# EAGLE schematic atv_02 (EAGLE 9.6.2)
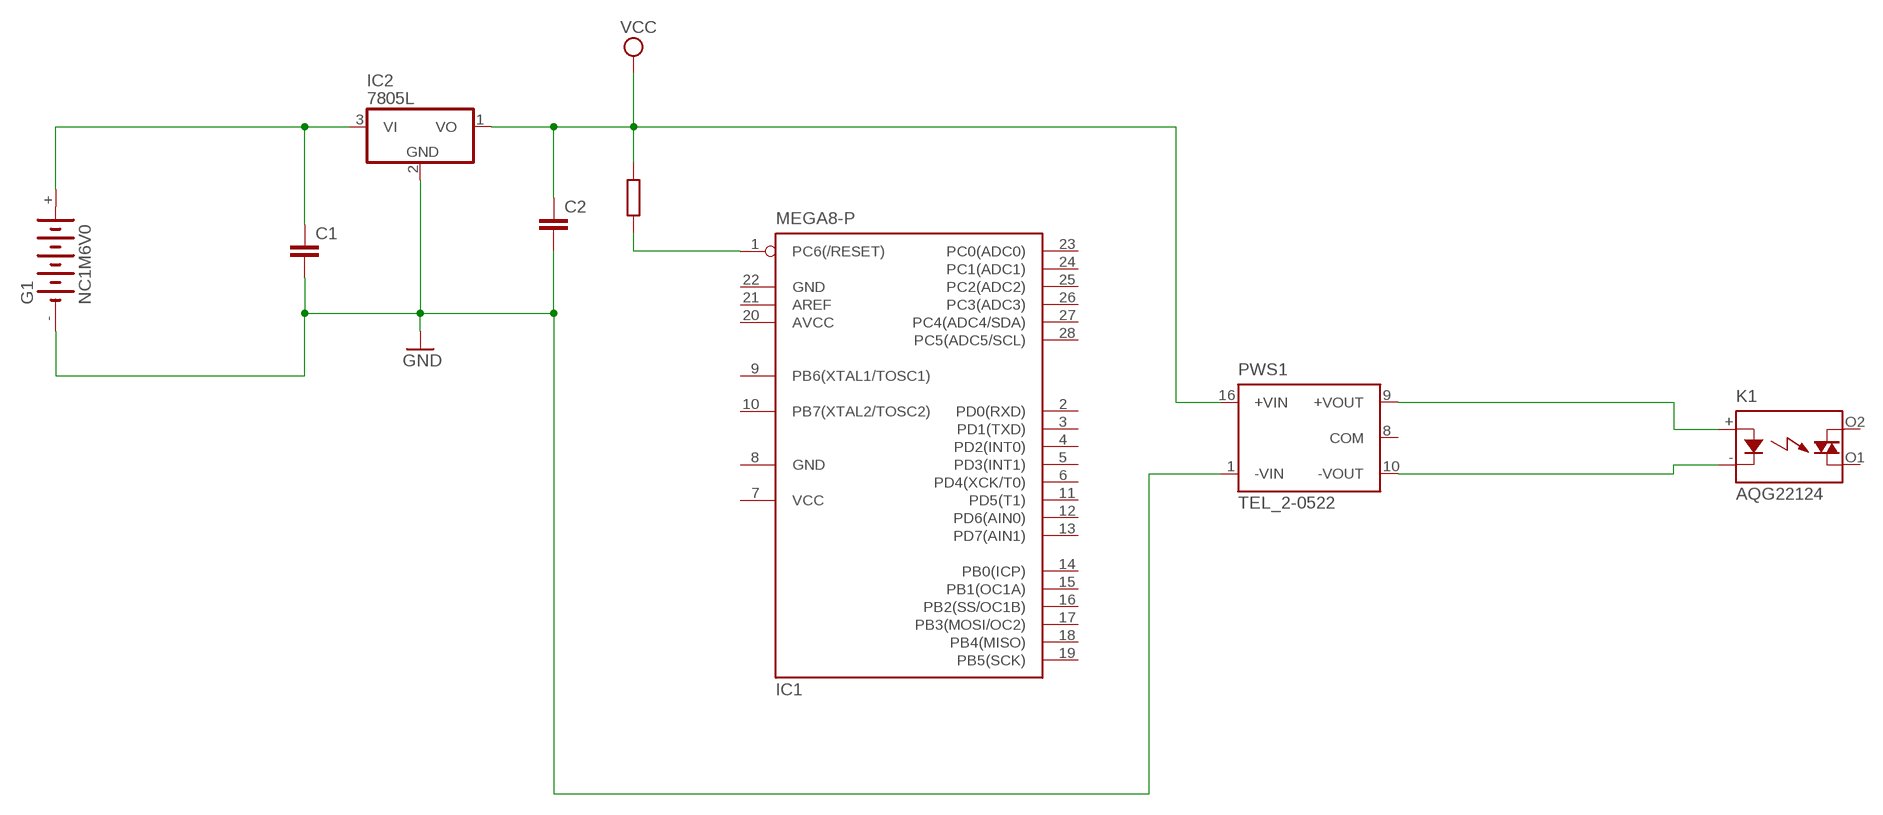
[diagram p0: schematic, sheet 1]

## Parts
C1  C2,5-3  [C2.5-3]
C2  C2,5-3  [C2.5-3]
G1  NC1M6V0  [NC1M]
IC1  MEGA8-P  [DIL28-3]
IC2  7805L  [TO92]
K1  AQG22124  [AQG]
PWS1  TEL_2-0522  [TRACOPOWER2W]

## Nets
GND: C1.2 C2.2 G1.- IC2.2(GND) PWS1.1(-VIN)
N$1: C1.1 G1.+ IC2.3(VI)
N$2: IC1.1(PC6(/RESET))
N$3: K1.+(A) PWS1.9(+VOUT)
N$4: K1.-(K) PWS1.10(-VOUT)
VCC: C2.1 IC2.1(VO) PWS1.16(+VIN)
Unconnected: IC1.2(PD0(RXD)) IC1.3(PD1(TXD)) IC1.4(PD2(INT0)) IC1.5(PD3(INT1)) IC1.6(PD4(XCK/T0)) IC1.9(PB6(XTAL1/TOSC1)) IC1.10(PB7(XTAL2/TOSC2)) IC1.11(PD5(T1)) IC1.12(PD6(AIN0)) IC1.13(PD7(AIN1)) IC1.14(PB0(ICP)) IC1.15(PB1(OC1A)) IC1.16(PB2(SS/OC1B)) IC1.17(PB3(MOSI/OC2)) IC1.18(PB4(MISO)) IC1.19(PB5(SCK)) IC1.21(AREF) IC1.23(PC0(ADC0)) IC1.24(PC1(ADC1)) IC1.25(PC2(ADC2)) IC1.26(PC3(ADC3)) IC1.27(PC4(ADC4/SDA)) IC1.28(PC5(ADC5/SCL)) K1.O1(DS2) K1.O2(DS1) PWS1.8(COM)

## Power pins joined to a net without a drawn wire
AVCC: IC1.20(AVCC)
GND: IC1.8(GND) IC1.22(GND)
VCC: IC1.7(VCC)

## Library data of the parts
C1 C2 = capacitor-wima:C: CAPACITOR naming: grid - package width
G1 = battery:NC1M6V0: NC ACCU Sonnenschein Mini-Memo NC-M 6.0V R5
IC1 = atmel:MEGA8-P: MICROCONTROLLER 8 Kbytes FLASH, 1 kbytes SRAM, 512 bytes EEPROM, USART, 4-channel 10 bit ADC, 2-channel 8 bit ADC Pin compatible with Atmega48, ATMega88, ATMega168 Source: avr.lbr; OC_FARNELL: unknown; OC_NEWARK: unknown
IC2 = adafruit:78*: Positive VOLTAGE REGULATOR Added bigger pads to the TO-92 package
K1 = relay:AQG*: SOLID STATE RELAY NAiS Zero-cross, Non zero-cross Source: http://www.mew-europe.com/.. en_ds_61611_0000.pdf; MPN: AQG22124; OC_FARNELL: unknown; OC_NEWARK: 11N2586
PWS1 = traco-electronic:TEL_2-: DC/DC-Konverter 2 Watt, 1 x Input, 1 x +- Output Source: http://www.tracopower.com/datasheet_g/tel2-d.pdf; MPN: TEL 2-0522; OC_FARNELL: 1007028; OC_NEWARK: 51R4756